# Altium schematic sheet sensor.schDoc: Sensor Controller
size A4; SheetNumber: 2; SheetTotal: 6
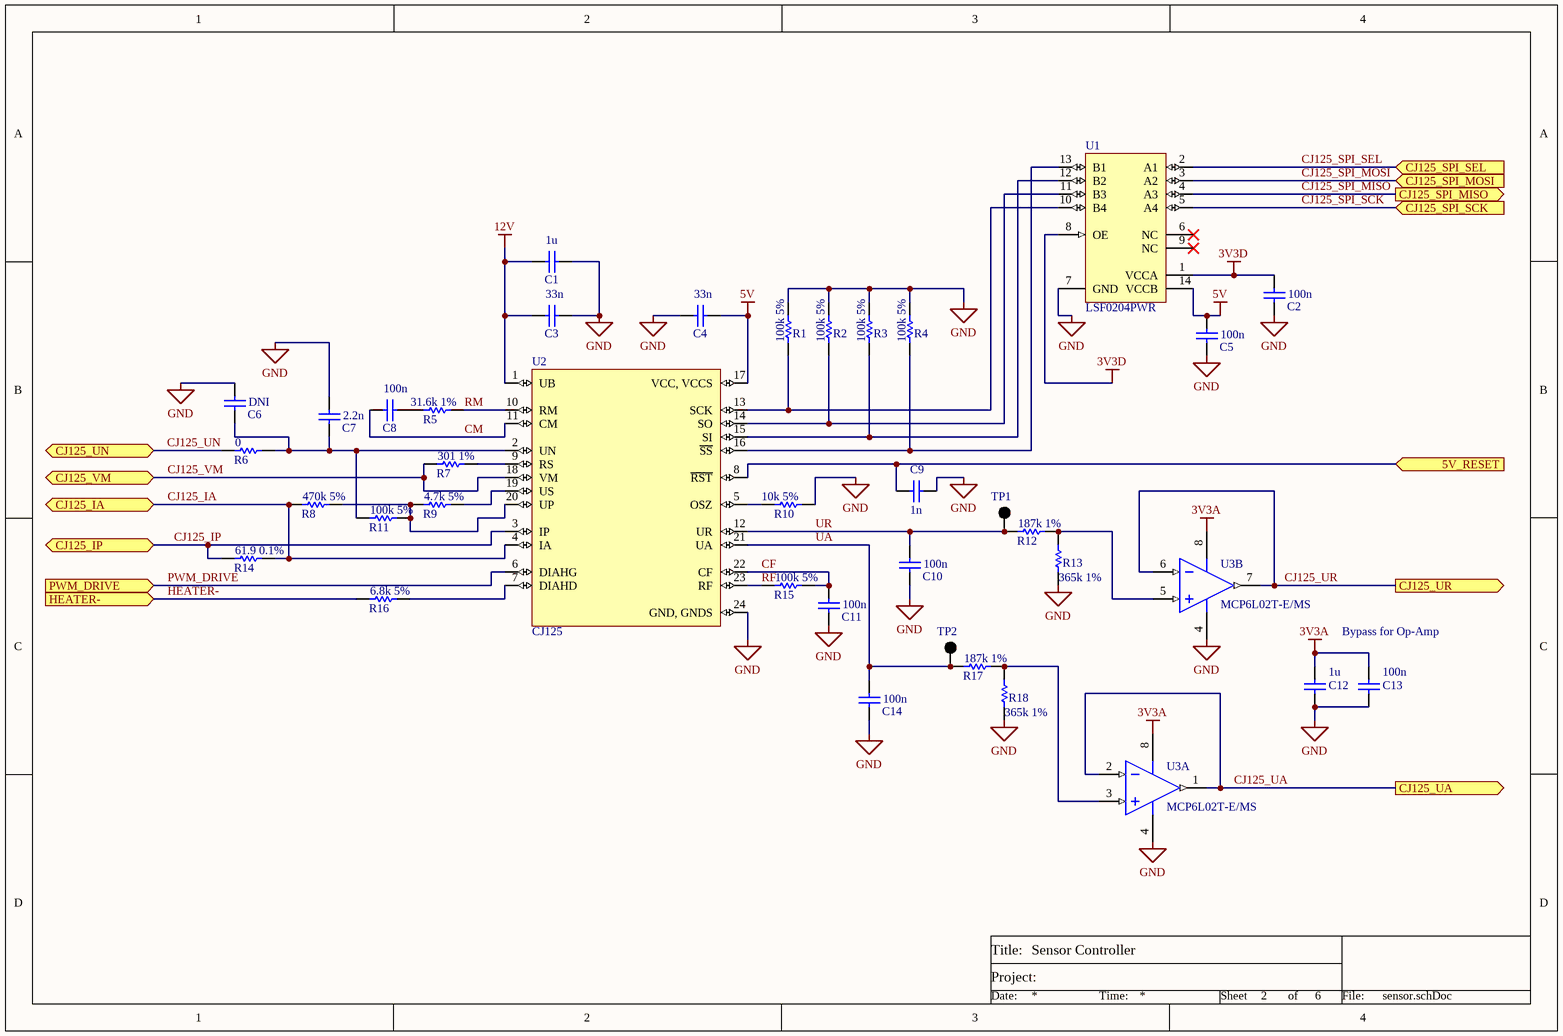
[diagram p0: sensor.schDoc]

## Parts
C1  value 1u  [0805]  (hidden comment: Generic 0805 Capacitor)
C2  value 100n  [0805]  (hidden comment: Generic 0805 Capacitor)
C3  value 33n  [0805]  (hidden comment: Generic 0805 Capacitor)
C4  value 33n  [0805]  (hidden comment: Generic 0805 Capacitor)
C5  value 100n  [0805]  (hidden comment: Generic 0805 Capacitor)
C6  value DNI  [0805]  (hidden comment: Generic 0805 Capacitor)
C7  value 2.2n  [0805]  (hidden comment: Generic 0805 Capacitor)
C8  value 100n  [0805]  (hidden comment: Generic 0805 Capacitor)
C9  value 1n  [0805]  (hidden comment: Generic 0805 Capacitor)
C10  value 100n  [0805]  (hidden comment: Generic 0805 Capacitor)
C11  value 100n  [0805]  (hidden comment: Generic 0805 Capacitor)
C12  value 1u  [0805]  (hidden comment: Generic 0805 Capacitor)
C13  value 100n  [0805]  (hidden comment: Generic 0805 Capacitor)
C14  value 100n  [0805]  (hidden comment: Generic 0805 Capacitor)
R1  value 100k 5%  [0603]  (hidden comment: Generic 0603 Resistor)
R2  value 100k 5%  [0603]  (hidden comment: Generic 0603 Resistor)
R3  value 100k 5%  [0603]  (hidden comment: Generic 0603 Resistor)
R4  value 100k 5%  [0603]  (hidden comment: Generic 0603 Resistor)
R5  value 31.6k 1%  [0603]  (hidden comment: Generic 0603 Resistor)
R6  value 0  [0603]  (hidden comment: Generic 0603 Resistor)
R7  value 301 1%  [0603]  (hidden comment: Generic 0603 Resistor)
R8  value 470k 5%  [0603]  (hidden comment: Generic 0603 Resistor)
R9  value 4.7k 5%  [0603]  (hidden comment: Generic 0603 Resistor)
R10  value 10k 5%  [0603]  (hidden comment: Generic 0603 Resistor)
R11  value 100k 5%  [0603]  (hidden comment: Generic 0603 Resistor)
R12  value 187k 1%  [0603]  (hidden comment: Generic 0603 Resistor)
R13  value 365k 1%  [0603]  (hidden comment: Generic 0603 Resistor)
R14  value 61.9 0.1%  [0603]  (hidden comment: Generic 0603 Resistor)
R15  value 100k 5%  [0603]  (hidden comment: Generic 0603 Resistor)
R16  value 6.8k 5%  [0603]  (hidden comment: Generic 0603 Resistor)
R17  value 187k 1%  [0603]  (hidden comment: Generic 0603 Resistor)
R18  value 365k 1%  [0603]  (hidden comment: Generic 0603 Resistor)
TP1  5001  [KSTN-5001]  (value not drawn)
TP2  5001  [KSTN-5001]  (value not drawn)
U1  LSF0204PWR  [PW0014A_M]
U2  CJ125  [SOIC-24]
U3  MCP6L02T-E/MS  [MSOP8_M]  (parts A,B of 2)

## Ports
5V_RESET (in), CJ125_IA (bidir), CJ125_IP (bidir), CJ125_SPI_MISO (out), CJ125_SPI_MOSI (in), CJ125_SPI_SCK (in), CJ125_SPI_SEL (in), CJ125_UA (out), CJ125_UN (bidir), CJ125_UR (out), CJ125_VM (bidir), HEATER- (in), PWM_DRIVE (in)

## Nets
3V3A: C12.2 C13.2 U3.8(VDD)
3V3D: C2.2 U1.1(VCCA) U1.8(OE)
5V: C4.1 C5.2 U1.14(VCCB) U2.17(VCC,_VCCS)
12V: C1.1 C3.2 U2.1(UB)
GND: C1.2 C2.1 C3.1 C4.2 C5.1 C6.2 C7.2 C9.2 C10.1 C11.1 C12.1 C13.1 C14.1 R1.2 R2.2 R3.2 R4.2 R10.2 R13.1 R18.1 U1.7(GND) U2.24(GND,_GNDS) U3.4(VSS)
5V_RESET: C9.1 U2.8(~{RST}) ; port 5V_RESET
CF: C11.2 R15.2 U2.22(CF)
CJ125_IA: R8.1 R14.2 U2.4(IA) ; port CJ125_IA
CJ125_IP: R14.1 U2.3(IP) ; port CJ125_IP
CJ125_SPI_MISO: U1.4(A3) ; port CJ125_SPI_MISO
CJ125_SPI_MOSI: U1.3(A2) ; port CJ125_SPI_MOSI
CJ125_SPI_SCK: U1.5(A4) ; port CJ125_SPI_SCK
CJ125_SPI_SEL: U1.2(A1) ; port CJ125_SPI_SEL
CJ125_UA: U3.1(VOUTA) U3.2(VINA-) ; port CJ125_UA
CJ125_UN: R6.1 ; port CJ125_UN
CJ125_UR: U3.6(VINB-) U3.7(VOUTB) ; port CJ125_UR
CJ125_VM: R7.1 U2.18(VM) ; port CJ125_VM
CM: C8.1 U2.11(CM)
HEATER-: R16.1 ; port HEATER-
PWM_DRIVE: U2.6(DIAHG) ; port PWM_DRIVE
RF: R15.1 U2.23(RF)
RM: R5.2 U2.10(RM)
UA: C14.2 R17.1 TP2.1 U2.21(UA)
UR: C10.2 R12.1 TP1.1 U2.12(UR)
NetC6_1: C6.1 C7.1 R6.2 R11.1 U2.2(UN)
NetC8_2: C8.2 R5.1
NetR1_1: R1.1 U1.10(B4) U2.13(SCK)
NetR2_1: R2.1 U1.11(B3) U2.14(SO)
NetR3_1: R3.1 U1.12(B2) U2.15(SI)
NetR4_1: R4.1 U1.13(B1) U2.16(~{SS})
NetR7_2: R7.2 U2.9(RS)
NetR8_2: R8.2 R9.1 R11.2 U2.20(UP)
NetR9_2: R9.2 U2.19(US)
NetR10_1: R10.1 U2.5(OSZ)
NetR12_2: R12.2 R13.2 U3.5(VINB+)
NetR16_2: R16.2 U2.7(DIAHD)
NetR17_2: R17.2 R18.2 U3.3(VINA+)

Not connected (* = marked no-connect by the designer): U1 6(NC)* 9(NC)*

## Notes on the sheet
- Bypass for Op-Amp
- Title:
- Project:
- Date:
- Time:
- Sheet
- of
- File:
- Title
- Size:
- E
- Number:
- Revision:

## Library data of the parts
C1-C14 = C_0805: Specifications: *
R1-R18 = R_0603: Specifications: *
TP1 TP2 = TP5001: Test Point, Black, 1-Pin THD, RoHS, Bulk; Manufacturer: Keystone; Other Names: 5001K; Catalog Drawings: 5000Series; Alternate Color: 5004K-ND / -TESTPOINTPCMINI.040"DYELLOW / 5003K-ND / -TESTPOINTPCMINI.040"DORANGE / 5002K-ND / -TESTPOINTPCMINI.040"DWHITE / 5000K-ND / -TESTPOINTPCMINI.040"DRED; Kits: DKTGRS232C-KIT-ND / -TTLCONVERTER; Online Catalog: ColorCodedTestPoints; Datasheet URL: https://ciiva.com/datasheet-click-2917627?src=ciiva&sig=bd195616; Mounting Type: 0.040"(1.02mm)HoleDiameter; Family: TestPoints; RoHS Information: RoHSComplianceStatement; Datasheet Version: Rev. G, 12/2008; Color: Black; Category: TestandMeasurement; Standard Package: 100; Manufacturer URL: http://www.keyelco.com/; Material: Base,Nylon46,UL94V-0; Type: PCTestPoint,Miniature; Terminal: 0.010"x0.020"(0.25mmx0.51mm)PhosphorBronzeWire,SilverPlated; Series: THM; Packaging: Bulk
U1 = LSF0204: 4-Bit Bidirectional Voltage-Level Translator with Automatic Direction Sensing and +/- 15-kV ESD Protection, -40 to 85 degC, 14-Pin TSSOP (PW), Green (RoHS & Sb/Br), Tape and Reel; Manufacturer: Texas Instruments; Dynamic Catalog: TXBSeries; Number of Bits: 4; Voltage - Supply: 1.2V~3.6V,1.65V~5.5V; Other Names: 296-21929-6; Propagation Delay (Max): 4ns; Logic Function: Translator,Bidirectional; Data Rate: 100Mbps; Differential - Input: Output:No/No; Number of Outputs/Channel: 1; Output Type: Logic; Product Training Modules: VoltageLevelTranslation; Number of Channels: 4; Package Reference: PW14; Package Description: 14-Pin Thin Shrink Small Outline Package, Body 5 x 4.4 mm, Pitch 0.65 mm; Datasheet Version: Rev. G, 11/2014; Manufacturer URL: http://www.ti.com/; Series: -; Packaging: Digi-Reel®; Mounting Technology: SurfaceMount; Family: Logic-Translators; Standard Package: 1; Category: IntegratedCircuits(ICs); Supplier Device Package: 14-TSSOP; Datasheet URL: http://www.ti.com/general/docs/lit/getliterature.tsp?genericPartNumber=TXB0104&fileType=pdf; Operating Temperature: -40°C~85°C; Input Type: Logic; Package / Case: 14-TSSOP(0.173",4.40mmWidth)
U2 = CJ125: 5V 2Mbaud SMT Lambda Probe Interface IC - SOIC-24; Supplier 1: Future Electronics; Package Reference: SOIC-24; Supplier Part Number 1: 0272240104
U3 = MCP6L02: 1 MHz, 85 Î¼A Dual Op Amp, 8-Pin MSOP, Extended Temperature Range, Tape and Reel; ComponentLink2URL: http://ww1.microchip.com/downloads/en/DeviceDoc/22140b.pdf; PackageDescription: 8-Lead Plastic Micro Small Outline Package (MS) [MSOP]; ComponentLink1URL: http://www.microchip.com/; ComponentLink1Description: Manufacturer URL; RevisionNote: URLs added. DatasheetVersion updated.; PackageVersion: revBB, Aug-2009; ComponentLink3URL: http://www.microchip.com/stellent/groups/techpub_sg/documents/packagingspec/en012702.pdf; ComponentLink2Description: Datasheet; ComponentLink3Description: Package Specification; DatasheetVersion: revB, Sep-2011; PackageReference: MSOP-MS8